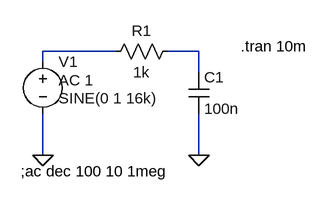
[diagram p0: schematic Draft2.asc]
Draft2.asc, the LTspice schematic file:
Version 4
SHEET 1 880 680
WIRE 112 48 0 48
WIRE 240 48 192 48
WIRE 0 64 0 48
WIRE 240 80 240 48
WIRE 0 208 0 144
WIRE 240 208 240 144
FLAG 0 208 0
FLAG 240 208 0
SYMBOL res 208 32 R90
WINDOW 0 0 56 VBottom 2
WINDOW 3 32 56 VTop 2
SYMATTR InstName R1
SYMATTR Value 1k
SYMBOL cap 224 80 R0
SYMATTR InstName C1
SYMATTR Value 100n
SYMBOL voltage 0 48 R0
WINDOW 3 24 72 Left 2
WINDOW 123 24 44 Left 2
WINDOW 39 0 0 Left 0
SYMATTR InstName V1
SYMATTR Value SINE(0 1 16k)
SYMATTR Value2 AC 1
TEXT -34 232 Left 2 !;ac dec 100 10 1meg
TEXT 304 40 Left 2 !.tran 10m

The netlist it stands for:
* Draft2.asc
R1 N002 N001 1k
C1 N002 0 100n
V1 N001 0 SINE(0 1 16k) AC 1
;ac dec 100 10 1meg
.tran 10m
.backanno
.end